# Altium schematic sheet [Sht1]TAUV-Dual_Lipo_Board.SchDoc
size A; SheetNumber: 1; SheetTotal: 1
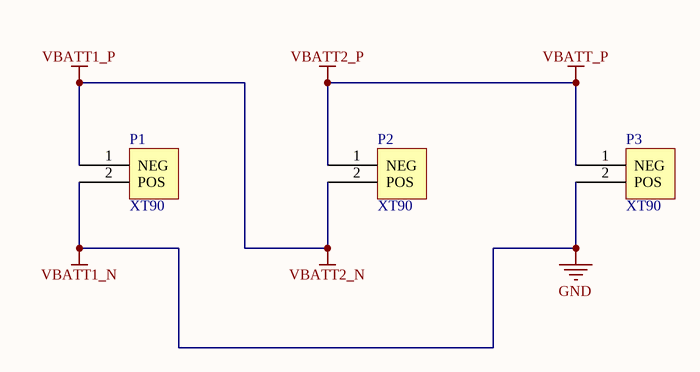
[diagram p0: [Sht1]TAUV-Dual_Lipo_Board.SchDoc]

## Parts
P1  XT90  [XT90]
P2  XT90  [XT90]
P3  XT90  [XT90]

## Nets
GND: P1.2(POS) P3.2(POS)  [also labelled VBATT1_N]
VBATT1_P: P1.1(NEG) P2.2(POS)  [also labelled VBATT2_N]
VBATT2_P: P2.1(NEG) P3.1(NEG)  [also labelled VBATT_P]